# Altium schematic sheet [03] Peripherals.SchDoc: Peripherals
size Letter; Revision: 1.0; PageSetup: Record=PageOptions|CenterHorizontal=True|CenterVertical=True|PrintScale=1.00|XCorrection=1.00|YCorrection=1.00|PrintKind=1|BorderSize=5000000|LeftOffset=0|BottomOffset=0|Orientation=2|PaperLength=1000|PaperWidth=1000|Scale=100|PaperSource=7|PrintQuality=-3|MediaType=1|DitherType=10|PrintScaleMode=1|PaperKind=Letter|PaperIndex=1; ProjectTitle: Data Acquisition System
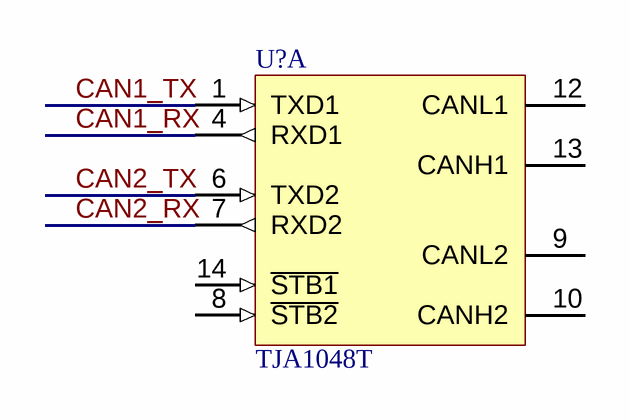
[diagram p0: [03] Peripherals.SchDoc]

## Parts
U?  TJA1048T  [SOP127P600X175-14N]  (part A of 2)

## Nets
CAN1_RX: U?.4(RXD1)
CAN1_TX: U?.1(TXD1)
CAN2_RX: U?.7(RXD2)
CAN2_TX: U?.6(TXD2)

Not connected (* = marked no-connect by the designer): U? 8(~{STB2}) 9(CANL2) 10(CANH2) 12(CANL1) 13(CANH1) 14(~{STB1})

## Notes on the sheet
- Date:
- Revision:
- Sheet
- of

## Library data of the parts
U? = TJA1048T: Dual CAN transceiver; Supplier 1: Digi-Key; Supplier Part Number 1: 568-8681-1-ND